# Altium schematic sheet 06_DRIVER.SchDoc: =TitleParameter
size A3; Organization: ASISGUARD; Address1: Kemalpasa, Kemalpasa Cd. No:290 D:292H, 35060 Bornova/Izmir/Turkey; SheetNumber: 9; SheetTotal: 14
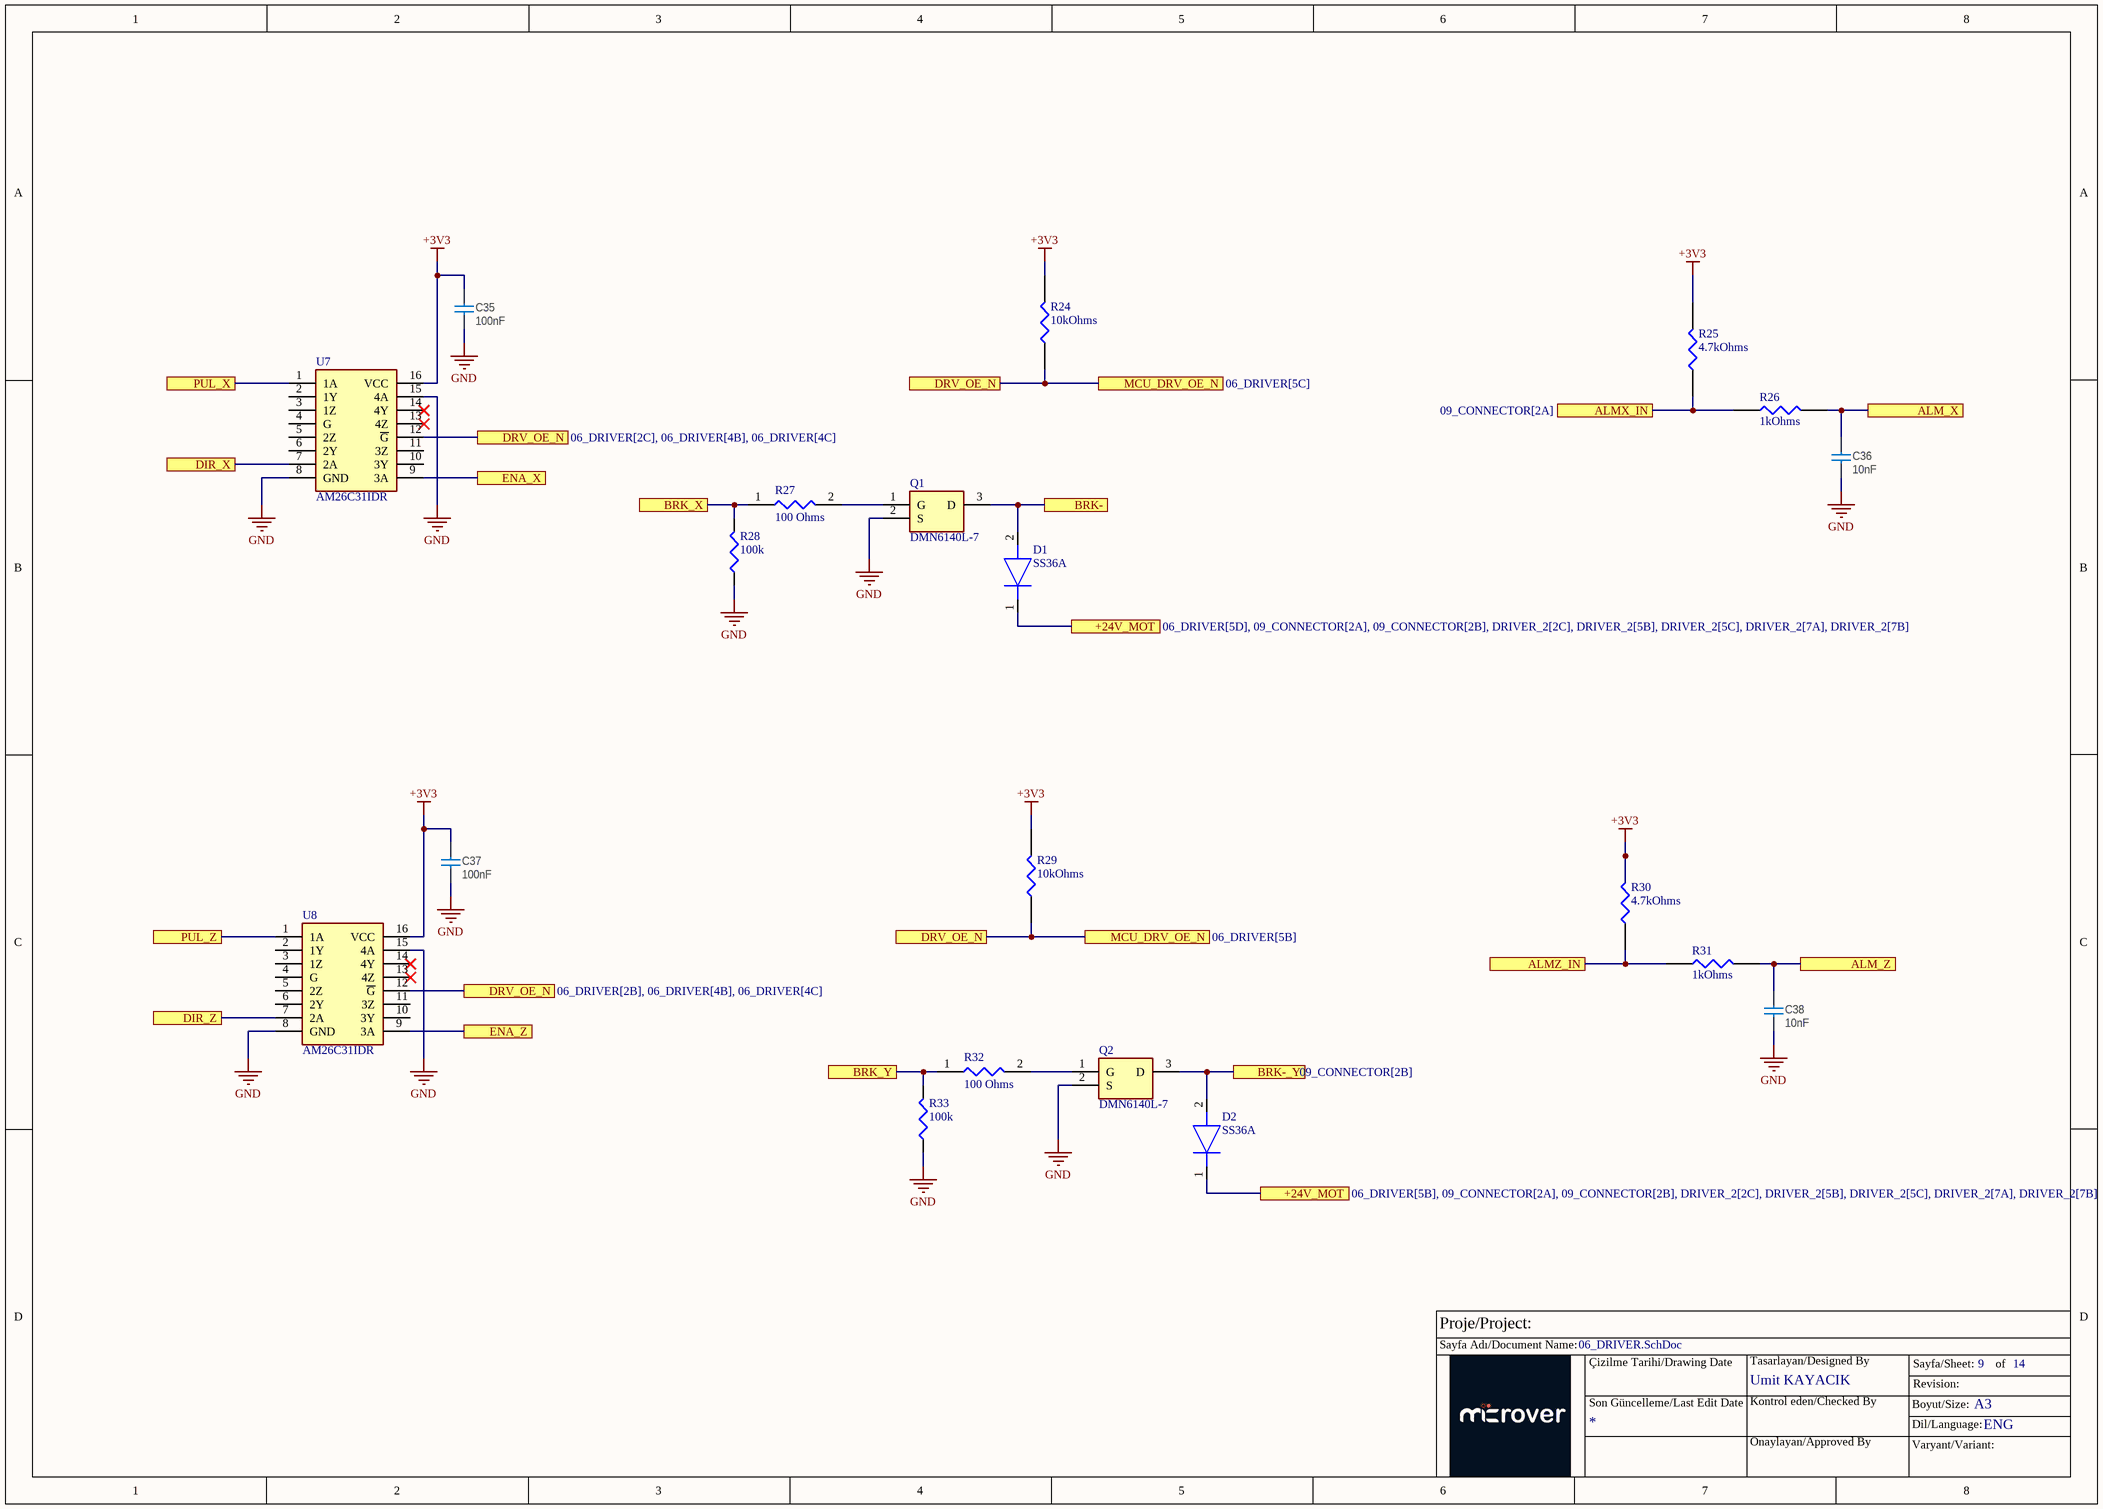
[diagram p0: 06_DRIVER.SchDoc]

## Parts
C35  100nF  [CAPC0603X03L_C]
C36  10nF  [CAPC0603X03L_C]
C37  100nF  [CAPC0603X03L_C]
C38  10nF  [CAPC0603X03L_C]
D1  SS36A  [DIOM5026X262N]
D2  SS36A  [DIOM5026X262N]
Q1  DMN6140L-7  [SOT96P240X110-3N]
Q2  DMN6140L-7  [SOT96P240X110-3N]
R24  10kOhms  [RESC0603X03L_C]
R25  4.7kOhms  [RES_0402]
R26  1kOhms  [RESC0603X03L_C]
R27  100 Ohms  [RESC1608X55N]
R28  value 100k  [SMR0603]  (hidden comment: RES 180K OHM 1% 1/10W 0603)
R29  10kOhms  [RESC0603X03L_C]
R30  4.7kOhms  [RES_0402]
R31  1kOhms  [RESC0603X03L_C]
R32  100 Ohms  [RESC1608X55N]
R33  value 100k  [SMR0603]  (hidden comment: RES 180K OHM 1% 1/10W 0603)
U7  AM26C31IDR  [SOIC127P600X175-16N]
U8  AM26C31IDR  [SOIC127P600X175-16N]

## Ports
+24V_MOT (see 06_DRIVER[5B], 09_CONNECTOR[2A], 09_CONNECTOR[2B], DRIVER_2[2C], DRIVER_2[5B], DRIVER_2[5C], DRIVER_2[7A], DRIVER_2[7B]), +24V_MOT (see 06_DRIVER[5D], 09_CONNECTOR[2A], 09_CONNECTOR[2B], DRIVER_2[2C], DRIVER_2[5B], DRIVER_2[5C], DRIVER_2[7A], DRIVER_2[7B]), ALM_X, ALM_Z, ALMX_IN (see 09_CONNECTOR[2A]), ALMZ_IN, BRK-, BRK-_Y (see 09_CONNECTOR[2B]), BRK_X, BRK_Y, DIR_X, DIR_Z, DRV_OE_N (see 06_DRIVER[2B], 06_DRIVER[2C], 06_DRIVER[4B]), DRV_OE_N (see 06_DRIVER[2B], 06_DRIVER[2C], 06_DRIVER[4C]), DRV_OE_N (see 06_DRIVER[2B], 06_DRIVER[4B], 06_DRIVER[4C]), DRV_OE_N (see 06_DRIVER[2C], 06_DRIVER[4B], 06_DRIVER[4C]), ENA_X, ENA_Z, MCU_DRV_OE_N (see 06_DRIVER[5B]), MCU_DRV_OE_N (see 06_DRIVER[5C]), PUL_X, PUL_Z

## Nets
+3V3: C35.2 C37.2 R24.2 R25.2 R29.2 R30.2 U7.16(VCC) U8.16(VCC)
GND: C35.1 C36.1 C37.1 C38.1 Q1.2(S) Q2.2(S) R28.1 R33.1 U7.8(GND) U7.15(4A) U8.8(GND) U8.15(4A)
+24V_MOT: D1.1(K) D2.1(K) ; port +24V_MOT
ALM_X: C36.2 R26.2 ; port ALM_X
ALM_Z: C38.2 R31.2 ; port ALM_Z
ALMX_IN: R25.1 R26.1 ; port ALMX_IN
ALMZ_IN: R30.1 R31.1 ; port ALMZ_IN
BRK-: D1.2(A) Q1.3(D) ; port BRK-
BRK-_Y: D2.2(A) Q2.3(D) ; port BRK-_Y
BRK_X: R27.1 R28.2 ; port BRK_X
BRK_Y: R32.1 R33.2 ; port BRK_Y
DIR_X: U7.7(2A) ; port DIR_X
DIR_Z: U8.7(2A) ; port DIR_Z
DRV_OE_N: R24.1 R29.1 U7.12(~{G}) U8.12(~{G}) ; port DRV_OE_N, port MCU_DRV_OE_N
ENA_X: U7.9(3A) ; port ENA_X
ENA_Z: U8.9(3A) ; port ENA_Z
PUL_X: U7.1(1A) ; port PUL_X
PUL_Z: U8.1(1A) ; port PUL_Z
NetQ1_1: Q1.1(G) R27.2
NetQ2_1: Q2.1(G) R32.2

Not connected (* = marked no-connect by the designer): U7 2(1Y) 3(1Z) 4(G) 5(2Z) 6(2Y) 10(3Y) 11(3Z) 13(4Z)* 14(4Y)*; U8 2(1Y) 3(1Z) 4(G) 5(2Z) 6(2Y) 10(3Y) 11(3Z) 13(4Z)* 14(4Y)*

## Notes on the sheet
- Proje/Project:
- Sayfa Adı/Document Name:
- Çizilme Tarihi/Drawing Date
- Umit KAYACIK
- Tasarlayan/Designed By
- Sayfa/Sheet:
- Revision:
- of
- Son Güncelleme/Last Edit Date
- Kontrol eden/Checked By
- Onaylayan/Approved By
- Boyut/Size:
- Varyant/Variant:
- Dil/Language:
- A3
- ENG

## Library data of the parts
C35 C37 = C0201-100n: Capacitor, X5R, ±10%; Manufacturer: N.A.; Part number IPS: 00000001248, 00000002505; Part number Norautron: 262071862; Part number NEMS: 100200078; Note: 16V; Pad Count: 2; Component Status: Active; Part Number: C0201-100n; Manufacturer Part Number: N.A.; ComponentLink1URL: N.A.; ComponentLink1Description: Datasheet; ComponentLink2URL: N.A.; ComponentLink2Description: Supplier link; HelpURL: N.A.; Footprint Doc: 0201; LatestRevisionDate: 2017-11-09; Published: 2014-11-13; Value: 100nF; Supplier 1: N.A.; Supplier Part Number 1: N.A.; Supplier 2: N.A.; Supplier Part Number 2: N.A.; Artikkelnr Noca: N.A.; PartId: 100200078; Component Class: Capacitors; Author: rsk
C36 C38 = C0201-10n: Capacitor, X7R, ±10%; Manufacturer: N.A.; Part number IPS: 00000003480; Part number Norautron: 26621779; Part number NEMS: 100200067; Note: 10V; Pad Count: 2; Component Status: Active; Part Number: C0201-10n; Manufacturer Part Number: N.A.; Footprint Doc: 0201; LatestRevisionDate: 2017-11-09; Published: 2014-11-13; Value: 10nF; Artikkelnr Noca: N.A.; ComponentLink1URL: N.A.; ComponentLink1Description: Datasheet; ComponentLink2URL: N.A.; ComponentLink2Description: Supplier link; HelpURL: N.A.; Supplier 1: N.A.; Supplier Part Number 1: N.A.; Supplier 2: N.A.; Supplier Part Number 2: N.A.; Author: rsk; Component Class: Capacitors; PartId: 100200067
D1 D2 = SS36A: Diode; Manufacturer_Name: HY Electronic; Height: 2.62mm; Manufacturer_Part_Number: SS36A
Q1 Q2 = DMN6140L-7: Transistor; Manufacturer_Name: Diodes Incorporated; Datasheet Link: https://www.diodes.com//assets/Datasheets/DMN6140L.pdf; Height: 1.1mm; Manufacturer_Part_Number: DMN6140L-7; Mouser Part Number: 621-DMN6140L-7; Mouser Price/Stock: https://www.mouser.co.uk/ProductDetail/Diodes-Incorporated/DMN6140L-7?qs=M%2FOdCRO8QQ0gki98nN7lXQ%3D%3D; Arrow Part Number: DMN6140L-7; Arrow Price/Stock: https://www.arrow.com/en/products/dmn6140l-7/diodes-incorporated?utm_currency=USD&region=asia
R24 R29 = TNPW060310K0FHTA: 10 kOhms ±1% 0.1W, 1/10W Chip Resistor 0603 (1608 Metric) Automotive AEC-Q200 Thin Film; Manufacturer: Vishay Dale; Supplier: Digi; 541-3906-6-ND
R25 R30 = RT0402FRE074K7L: RES SMD 4.7K OHM 1% 1/16W 0402; Manufacturer: Yageo Group; Max Power Dissipation: 63mW; Power Rating: 62.5mW; Temperature Coefficient: 50ppm/°C; Voltage Rating: 50V; Case Code (Imperial): 0402; Case/Package: 0402; Category: Chip SMD Resistors; China RoHS: Non-Compliant; Composition: Thin Film; Contact Plating: Lead, Tin; Country of Origin: Mainland China; Export Control Classification Number (ECCN) Code: EAR99; Features: Moisture Resistant; Harmonized Tariff Schedule (HTS) Code: 8533.21.00.30; Height: 300µm; Introduction Date: 2008-06-09; Lead Free: Lead Free; Length: 1mm; Lifecycle Status: Production; Manufacturer Part Number: RT0402FRE074K7L; Max Operating Temperature: 155°C; Min Operating Temperature: -55°C; Mounting Technology: Surface Mount; Number of Terminals: 2; Number of Terminations: 2; Radiation Hardening: No; REACH SVHC: Yes; RoHS: Compliant; Schedule B: 8533210045, 8533210045|8533210045, 8533210045|8533210045|8533210045, 8533210045|8533210045|8533210045|8533210045; Termination: SMD/SMT; Tolerance: 1%; Voltage Rating (DC): 50V; Width: 500µm; Working Voltage: 50V; Value: 4.7kOhms
R26 R31 = CPF0603B1K0E: RES SMD 1K OHM 0.1% 1/16W 0603; Manufacturer: TE Connectivity; Manufacturer Lifecycle Status: ACTIVE; Max Power Dissipation: 63mW; Number of Resistors: 1; Operating Supply Voltage: 50V; Temperature Coefficient: 25ppm/°C; Case Code (Metric): 1608; Case/Package: 0603; Category: Chip SMD Resistors; China RoHS: Compliant; Composition: Thin Film; Depth: 800µm; ELV: Compliant; Export Control Classification Number (ECCN) Code: EAR99; Harmonized Tariff Schedule (HTS) Code: 8533.21.00.30; Height: 450µm; Introduction Date: 2009-09-20; Length: 1.55mm; Lifecycle Status: Production; Manufacturer Part Number: CPF0603B1K0E; Max Operating Temperature: 155°C; Min Operating Temperature: -55°C; Mounting Technology: Surface Mount; Number of Terminals: 2; Number of Terminations: 2; Packaging: Tape and Reel; Power Rating: 63mW; Radiation Hardening: No; REACH SVHC: Yes; RoHS: Compliant; Schedule B: 8533210045|8533210045|8533210045|8533210045|8533210045; Termination: Solder; Tolerance: 0.1%; Voltage Rating: 50V; Voltage Rating (DC): 50V; Weight: 2.012816mg; Width: 800µm; Working Voltage: 50V; Value: 1kOhms
R27 R32 = RC0603JR07100RL: Resistor; Manufacturer_Name: Yageo Group; Datasheet Link: http://www.yageo.com/documents/recent/PYu-RC0603_51_RoHS_L_v5.pdf; Height: 0.55mm; Manufacturer_Part_Number: RC0603JR07100RL; Arrow Part Number: RC0603JR07100RL; Arrow Price/Stock: https://www.arrow.com/en/products/rc0603jr-07100rl/yageo
R28 R33 = RES0603_100K_%1: 100 kOhms ±1% 0.1W, 1/10W Chip Resistor 0603 (1608 Metric) Moisture Resistant Thick Film; Manufacturer Part Number: RC0603FR-07100KL; Order Code: DIGI : 311-100KHRTR-ND; LCSC Manufacturer Part Number: RC0603FR-07100KL; LCSC Part Number: C123419
U7 U8 = AM26C31IDR: 4/0 Driver 16-SOIC; Manufacturer: Texas Instruments; Supplier: Digi; 296-24344-6-ND